# EAGLE design air_valve_test (EAGLE 8.5.0)
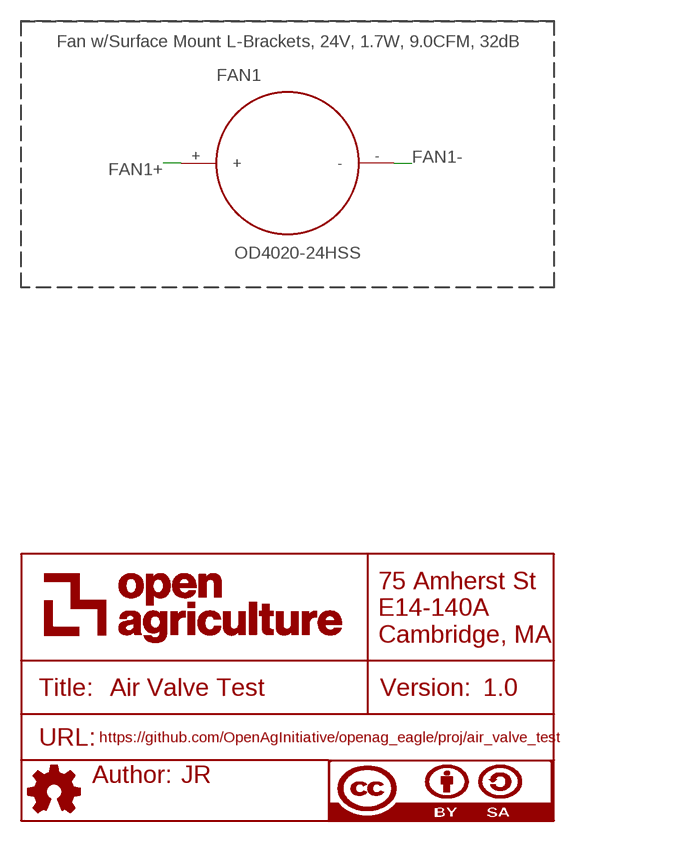
[diagram p0: schematic, sheet 1]

## Parts
FAN1  OD4020-24HSS  [OD4020-24HSS]
FRAME1  DOCFIELD  [DOCFIELD]

## Nets
FAN1+: FAN1.+
FAN1-: FAN1.-

## Notes on the sheet
- Fan w/Surface Mount L-Brackets, 24V, 1.7W, 9.0CFM, 32dB

## Library data of the parts
FAN1 = openag-fans:OD4020-24HSS: Orion Fans - OD4020-24HSS - FAN AXIAL 40X20MM 24VDC WIRE Description: FAN AXIAL 40X10.5MM 24VDC WIRE Technical Specifications: Voltage - Rated: 24VDC Size / Dimension: Square - 40mm L x 40mm H Width: 20.00mm Air Flow: 9.0 CFM (0.252m³/min) Static Pressure: 0.300 in H2O (74.7 Pa) Bearing Type: Sealed Sleeve Fan Type: Tubeaxial Noise: 32.0 dB Power (Watts): 1.70W RPM: 7800 RPM Termination: 2 Wire Leads Operating Temperature: 14 ~ 158°F (-10 ~ 70°C) Approvals: CE, UR Current Rating: 0.090A Material - Frame: Polybutylene Terephthalate (PBT), Fiberglass Reinforced Material - Blade: Polybutylene Terephthalate (PBT), Fiberglass Reinforced Datasheet(s): AC,DC Part Number Guide <http://www.orionfans.com/images/files/Part_Number_Construction_Guide.pdf> OD4020 Series xSS <http://www.orionfans.com/media/parts/dcfans/ss_od4020_12_24.pdf> Orion Fan Catalog <http://orionfans.com/images/files/orion-fans-product-catalog.pdf> Circuit Diagrams <http://www.orionfans.com/images/files/circuit_diagrams.pdf> OD40 Series Panel Cutout <http://www.orionfans.com/3d-drawings/OD40_series-panel-cutout.pdf> Vendor(s): Digikey: 1053-1220-ND <https://www.digikey.com/product-detail/en/orion-fans/OD4020-24HSS/1053-1220-ND/2621125>; MANUFACTURER: Orion Fans; MPN: OD4020-24HSS; VENDOR: DIGIKEY; VENDOR-LINK: https://www.digikey.com/product-detail/en/orion-fans/OD4020-24HSS/1053-1220-ND/2621125; VPN: 1053-1220-ND
FRAME1 = openag-frames:DOCFIELD: DOCUMENT FIELD; AUTHOR: JR; DESCRIPTION: Fan + valve test for pfc edu brain; TITLE: Air Valve Test; URL: https://github.com/OpenAgInitiative/openag_eagle/proj/air_valve_test; VER: 1.0

## Board
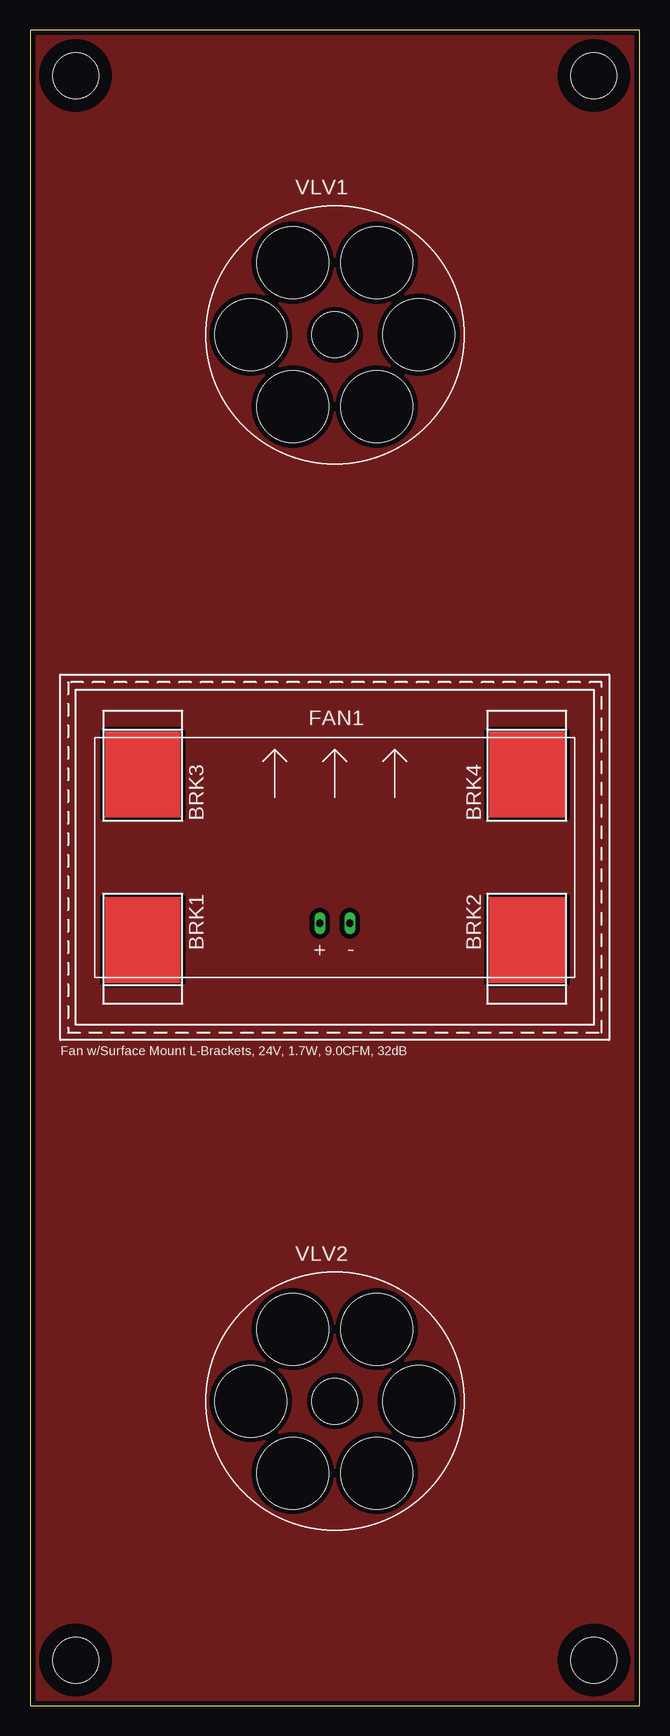
[diagram p1: board, top side]
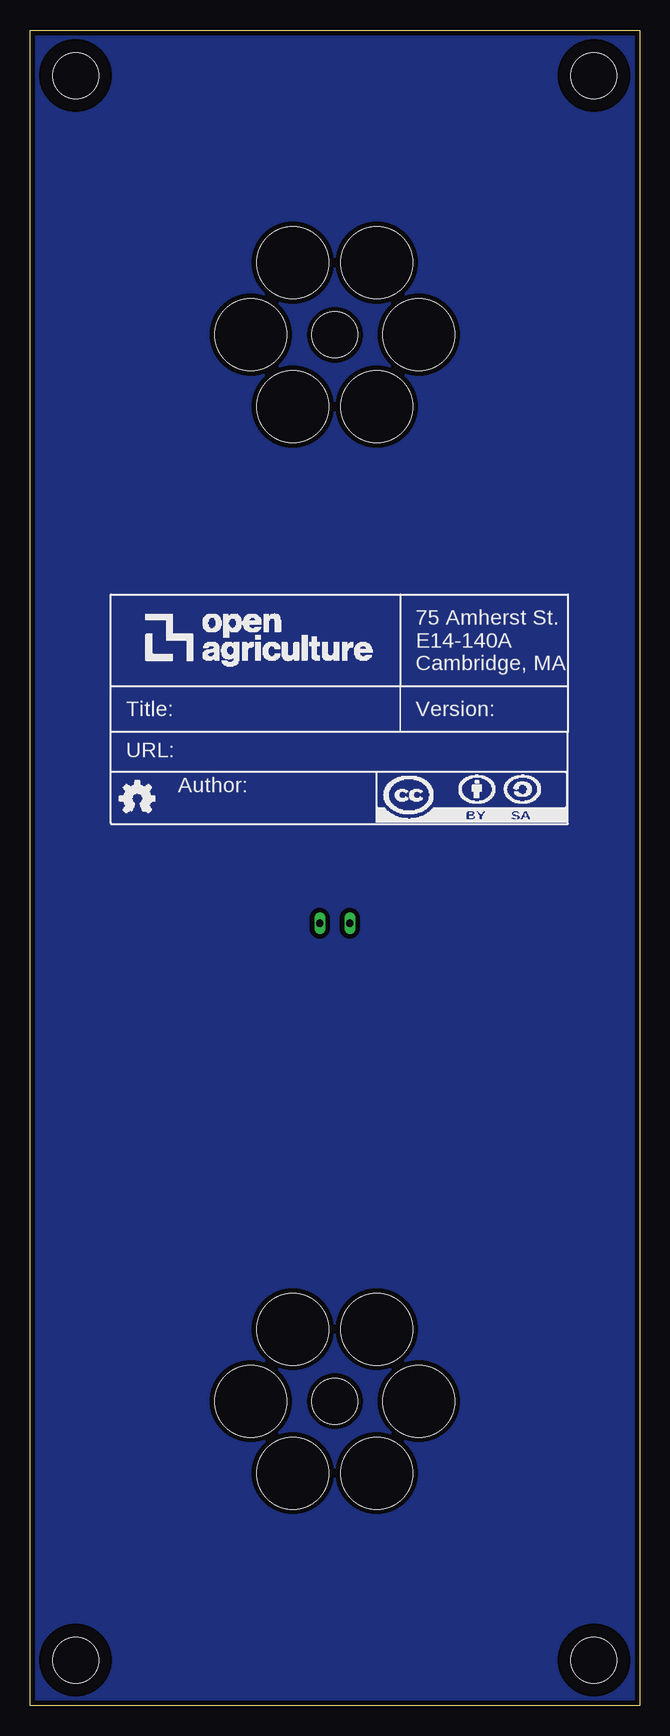
[diagram p2: board, bottom side, seen from below]

Size 50.8 x 139.7 mm. Coordinates in mm from the lower left corner, seen from the top.
Outline: 0,0 50.8,0 50.8,139.7 0,139.7 0,0
Copper layers (1*16): Top 0.035559375mm / dielectric 1.6mm / Bottom 0.035559375mm
Design rules "openag-router": minimum track width 6mil, minimum drill 10mil, track to track 16mil, track to pad 16mil, pad to pad 16mil, via to via 16mil, smd to smd 16mil, copper to edge 15mil, drill to drill 6mil, minimum pad ring 5mil, minimum via ring 5mil, stop-mask expansion 2.5mil, vias tented up to drill 20mil, thermal gap 10mil

### Footprints (pad centres in the part's own frame; a part is rotated, then mirrored left to right if it is on the bottom)
OD4020-24HSS = drill 0.6 long: + -1.254,-5.49; - 1.254,-5.49
OPENAG-CORNER-MOUNTING-HOLE = hole 3.81: 0,0
UM215.002-151.02 = hole 6: -7,0; 7,0; -3.5,6; 3.5,6; -3.5,-6; 3.5,-6 | hole 3.81: 0,0

### Placement (x,y rotation side)
BRK1  [612]  9.4,63.88 180 top
BRK2  [612]  41.4,63.88 180 top
BRK3  [612]  9.4,77.6 0 top
BRK4  [612]  41.4,77.6 0 top
FAN1  25.4,70.74 0 top
FRAME1  44.07,73.53 0 bottom
U$1  [OPENAG-CORNER-MOUNTING-HOLE]  3.81,3.81 0 top
U$2  [OPENAG-CORNER-MOUNTING-HOLE]  3.81,135.89 270 top
U$3  [OPENAG-CORNER-MOUNTING-HOLE]  46.99,135.89 180 top
U$4  [OPENAG-CORNER-MOUNTING-HOLE]  46.99,3.81 90 top
VLV1  [UM215.002-151.02]  25.4,114.3 0 top
VLV2  [UM215.002-151.02]  25.4,25.4 0 top

### Tracks (layer width: path | path; a pad name or v marks a point on that pad's centre or on a via)
GND
  pour Top (isolate 0.406, rank 3): 0,0 50.8,0 50.8,139.7 0,139.7
  pour Bottom (isolate 0.406, rank 3): 0,139.7 50.8,139.7 50.8,0 0,0

### Text on the board
tPlace: Fan w/Surface Mount L-Brackets, 24V, 1.7W, 9.0CFM, 32dB